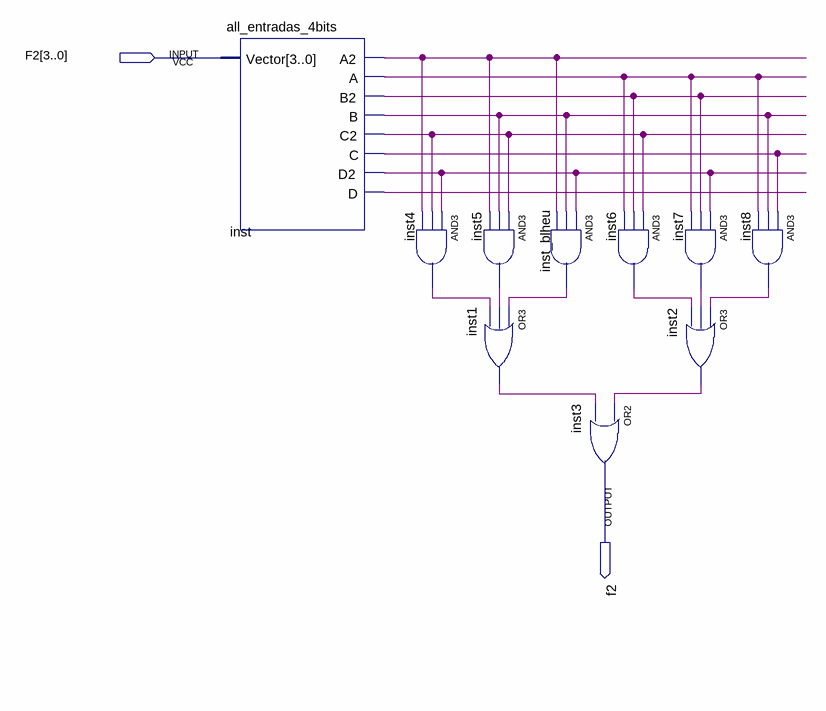
[diagram p0: schematic sheet]
// Quartus schematic f2_4bits.bdf as structural Verilog: 10 symbols, 2 pins
module f2_4bits (
  input  [3:0] F2,
  output F2_1bit
);

  wire inst1_out, inst2_out, inst4_out, inst5_out, inst6_out, inst7_out, inst8_out, inst_a, inst_a2, inst_b,
       inst_b2, inst_blheu_out, inst_c, inst_c2, inst_d, inst_d2;

  all_entradas_4bits inst (
    .Vector(F2), .A2(inst_a2), .A(inst_a), .B2(inst_b2), .B(inst_b), .C2(inst_c2), .C(inst_c), .D2(inst_d2),
    .D(inst_d));
  and inst4 (inst4_out, inst_d2, inst_c2, inst_a2);
  and inst5 (inst5_out, inst_c2, inst_b, inst_a2);
  or inst1 (inst1_out, inst_blheu_out, inst5_out, inst4_out);
  and inst_blheu (inst_blheu_out, inst_d2, inst_b, inst_a2);
  and inst6 (inst6_out, inst_c2, inst_b2, inst_a);
  or inst3 (F2_1bit, inst2_out, inst1_out);
  and inst7 (inst7_out, inst_d2, inst_b2, inst_a);
  or inst2 (inst2_out, inst8_out, inst7_out, inst6_out);
  and inst8 (inst8_out, inst_c, inst_b, inst_a);
endmodule
